# Altium schematic sheet airPi_Controller.schdoc
size 315 x 214 mm
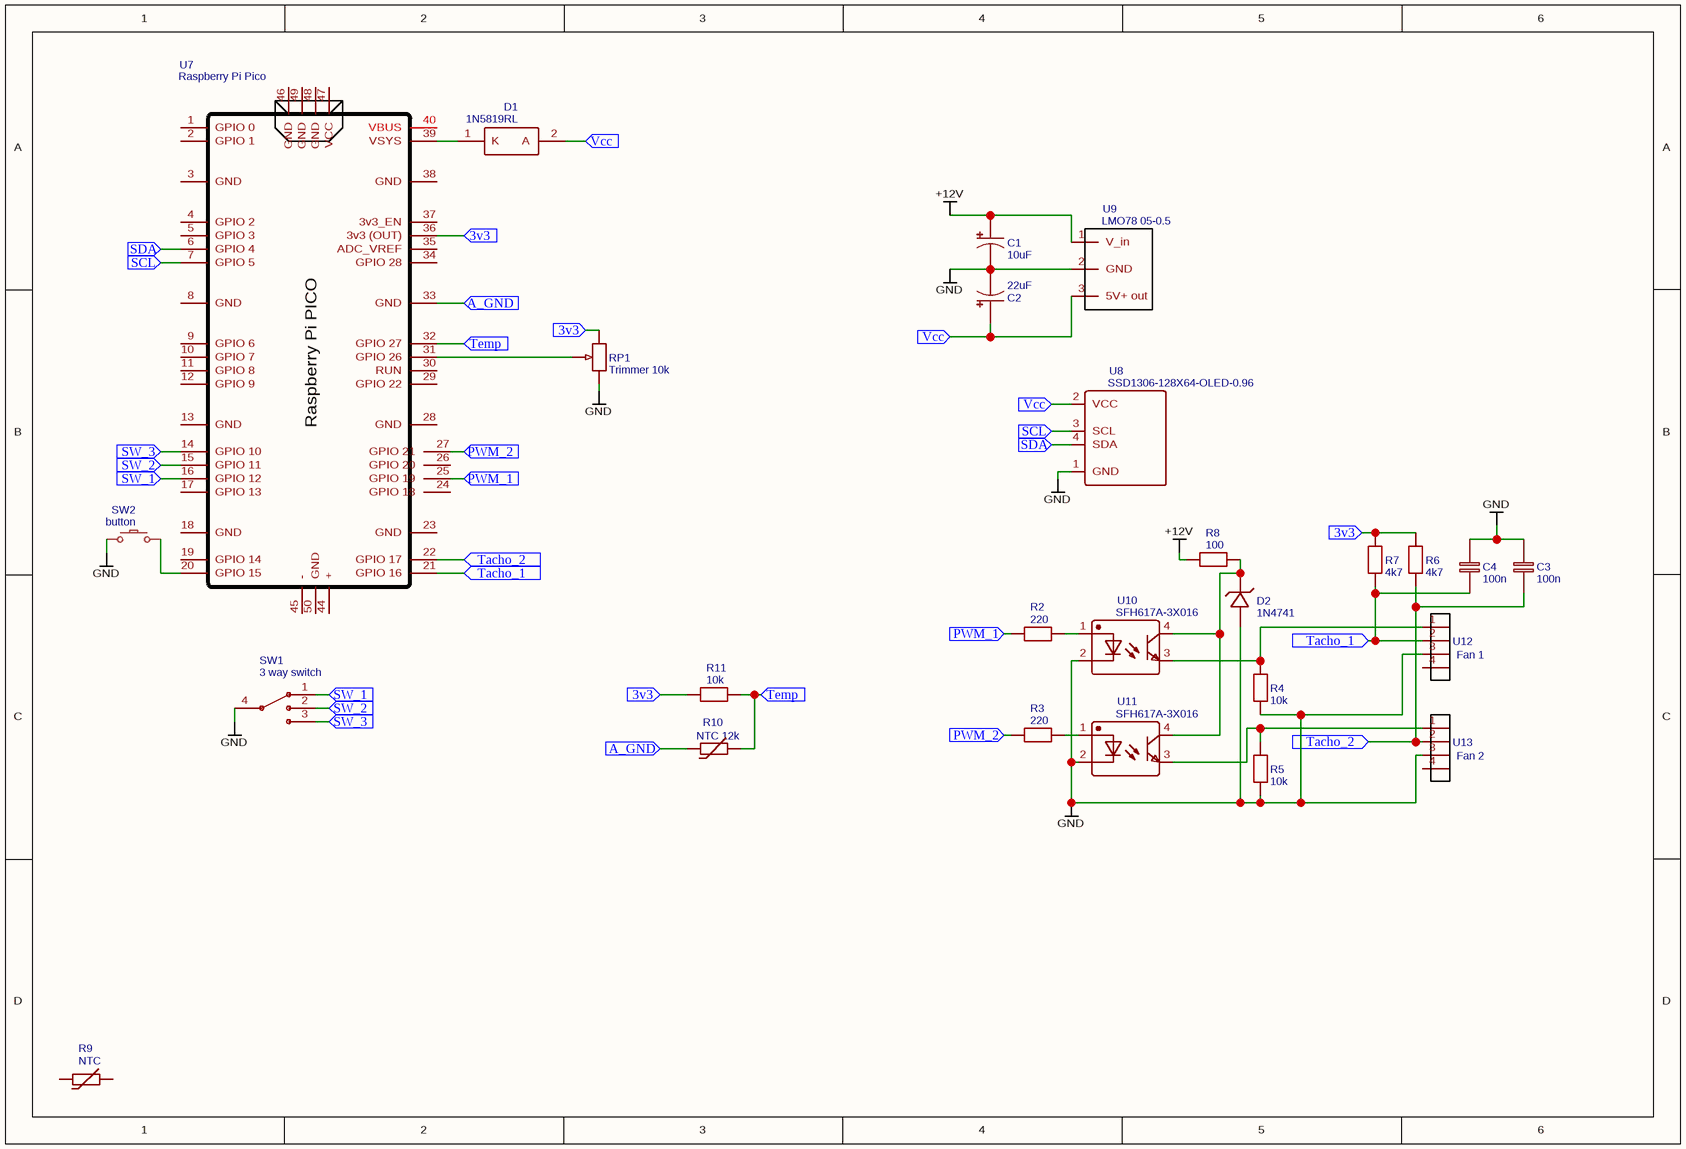
[diagram p0: airPi_Controller.schdoc]

## Parts
C1  10uF  [TANTALUM]
C2  22uF  [TANTALUM]
C3  100n  [C0603]
C4  100n  [C0603]
D1  1N5819RL  [ONSC-AXIAL_LEAD-2-59-10_P]
D2  1N4741  [DO-41_BD2.4-L4.7-P8.70-D0.9-RD]
R2  220  [R0603]
R3  220  [R0603]
R4  10k  [R0603]
R5  10k  [R0603]
R6  4k7  [R0603]
R7  4k7  [R0603]
R8  100  [R0603]
R9  NTC  [RES-TH_L10.5-W5.5-P7.50-D0.6-S5.50]
R10  NTC 12k  [RES-TH_L10.5-W5.5-P7.50-D0.6-S5.50]
R11  10k  [R0603]
RP1  Trimmer 10k  [RES-ADJ-TH_3386P]
SW1  3 way switch  [3 WAY SWITCH SMT]
SW2  button  [32TEETH---CONDUCTIVE-BUTTONS_CONDUCTIVE_BUTTON_DIRECTIONAL_THICK]
U7  Raspberry Pi Pico  [RASPBERRY PI PICO/ RASPBERRY PI PICO W]
U8  SSD1306-128X64-OLED-0.96  [SSD1306]
U9  LMO78 05-0.5  [5V DC/DC]
U10  SFH617A-3X016  [DIP-4_L6.5-W4.6-P2.54-LS10.2-BL]
U11  SFH617A-3X016  [DIP-4_L6.5-W4.6-P2.54-LS10.2-BL]
U12  Fan 1  [MOLEX_MINIFIT-JR-5569]
U13  Fan 2  [MOLEX_MINIFIT-JR-5569]

## Ports
3v3 (in), A_GND (in), PWM_1 (in), PWM_2 (in), SCL (in), SDA (in), SW_1 (in), SW_2 (in), SW_3 (in), Tacho_1 (in), Tacho_2 (in), Temp (in), Vcc (in)

## Nets
+12V: C1.1 R8.2 U9.1(V_in)
GND: C1.2 C2.2 C3.2 C4.2 D2.2(A) R4.1 R5.1 RP1.1 SW1.4 SW2.P$ACTIVE U8.1(GND) U9.2(GND) U10.2(C) U11.2(C) U12.3 U13.3
3v3: R6.2 R7.2 R11.1 RP1.3 U7.36(3v3_(OUT)) ; port 3v3
A_GND: R10.1 U7.33(GND) ; port A_GND
PWM_1: R2.1 U7.25(GPIO_19) ; port PWM_1
PWM_2: R3.1 U7.27(GPIO_21) ; port PWM_2
SCL: U7.7(GPIO_5) U8.3(SCL) ; port SCL
SDA: U7.6(GPIO_4) U8.4(SDA) ; port SDA
SW_1: SW1.1 U7.16(GPIO_12) ; port SW_1
SW_2: SW1.2 U7.15(GPIO_11) ; port SW_2
SW_3: SW1.3 U7.14(GPIO_10) ; port SW_3
Tacho_1: C4.1 R7.1 U7.21(GPIO_16) U12.2 ; port Tacho_1
Tacho_2: C3.1 R6.1 U7.22(GPIO_17) U13.2 ; port Tacho_2
Temp: R10.2 R11.2 U7.32(GPIO_27) ; port Temp
Vcc: C2.1 D1.2(A) U8.2(VCC) U9.3(5V+_out) ; port Vcc
NetD1_1: D1.1(K) U7.39(VSYS)
NetD2_1: D2.1(K) R8.1 U10.4(C) U11.4(C)
NetR2_2: R2.2 U10.1(A)
NetR3_2: R3.2 U11.1(A)
NetR4_2: R4.2 U10.3(E) U12.1
NetR5_2: R5.2 U11.3(E) U13.1
NetRP1_2: RP1.2 U7.31(GPIO_26)
NetSW2_P$GND: SW2.P$GND U7.20(GPIO_15)

Not connected (* = marked no-connect by the designer): R9 1 2; U7 1(GPIO_0) 2(GPIO_1) 3(GND) 4(GPIO_2) 5(GPIO_3) 8(GND) 9(GPIO_6) 10(GPIO_7) 11(GPIO_8) 12(GPIO_9) 13(GND) 17(GPIO_13) 18(GND) 19(GPIO_14) 23(GND) 24(GPIO_18) 26(GPIO_20) 28(GND) 29(GPIO_22) 30(RUN) 34(GPIO_28) 35(ADC_VREF) 37(3v3_EN) 38(GND) 40(VBUS) 44(+) 45(-) 46(GND) 47(VCC) 48(GND) 49(GND) 50(GND); U12 4; U13 4

## Notes on the sheet
- (in symbol Raspberry Pi Pico) Raspberry Pi PICO

## Library data of the parts
C1 = 10uF: nameAlias: Value(F); Contributor: hafiz_8030; spicePre: C; spiceSymbolName: TANTALE-10µF
C2 = 22uF: nameAlias: Value(F); Contributor: hafiz_8030; spicePre: C; spiceSymbolName: TANTALE-10µF
C3 C4 = 100n: nameAlias: Value(F); Contributor: LCEDA_Lib; spicePre: C; spiceSymbolName: C_0603_EU
D1 = 1N5819RL: description: Rectifier, 2-Pin Axial_Lead, Pb-Free, Tape and Reel; spicePre: D; spiceSymbolName: 1N5819RL
D2 = 1N4741: Manufacturer: onsemi(安森美); Manufacturer Part: 1N4741A; Contributor: LCSC; Supplier: LCSC; Supplier Part: C238927; JLCPCB Part Class: Extended Part; spicePre: D; spiceSymbolName: 1N4741A_C238927
R2 R3 = 220: nameAlias: Value(Ω); Contributor: LCEDA_Lib; spicePre: R; spiceSymbolName: R_0603_EU
R4 R5 R11 = 10k: nameAlias: Value(Ω); Contributor: LCEDA_Lib; spicePre: R; spiceSymbolName: R_0603_EU
R6 R7 = 4k7: nameAlias: Value(Ω); Contributor: LCEDA_Lib; spicePre: R; spiceSymbolName: R_0603_EU
R8 = 100: nameAlias: Value(Ω); Contributor: LCEDA_Lib; spicePre: R; spiceSymbolName: R_0603_EU
R9 = NTC: Manufacturer: RUILON(瑞隆源); Manufacturer Part: NTC 5D-9(弯脚); nameAlias: Value; Supplier: LCSC; Supplier Part: C3789; JLCPCB Part Class: Extended Part; spicePre: R; spiceSymbolName: NTC 5D-9
R10 = NTC 12k: Manufacturer: RUILON(瑞隆源); Manufacturer Part: NTC 5D-9(弯脚); nameAlias: Value; Supplier: LCSC; Supplier Part: C3789; JLCPCB Part Class: Extended Part; spicePre: R; spiceSymbolName: NTC 5D-9
RP1 = Trimmer 10k: nameAlias: Resistance (Ohms); Contributor: LCEDA_Lib; Supplier: LCSC; Value(Ω): 10K; spicePre: R; spiceSymbolName: R_3386P_EU
SW1 = 3 way switch: Manufacturer: ReliaPro; Manufacturer Part: MSK-11027 Toggle Switches; Contributor: ClivePCBDesign; Supplier Part: C21381; image: http://image.lceda.cn/szlcsc/C21381.jpg; spicePre: K; spiceSymbolName: 3 way switch
SW2 = button: Contributor: laura.puyet1; spicePre: ?; spiceSymbolName: button
U7 = Raspberry Pi Pico: Contributor: grawik; spicePre: U; spiceSymbolName: Raspberry Pi Pico
U8 = SSD1306-128X64-OLED-0.96: sourceId: wICUcuL3l; Contributor: Think Service; spicePre: X; timeStamp: 1456014235; spiceSymbolName: SSD1306-128X64-OLED-0.96
U9 = LMO78 05-0.5: Contributor: Martin Heiter; spicePre: U; spiceSymbolName: 5V DC/DC Converter Gaptec LMO78 05-0.5 2,5W
U10 U11 = SFH617A-3X016: Manufacturer: VISHAY(威世); Contributor: lcsc; Supplier: LCSC; Supplier Part: C5273047; Manufacturer Part: SFH617A-3X016; spicePre: U; spiceSymbolName: SFH617A-3X016
U12 = Fan 1: Contributor: s1atbewie.de; spicePre: U; spiceSymbolName: MolexMiniFit Jr 02*02
U13 = Fan 2: Contributor: s1atbewie.de; spicePre: U; spiceSymbolName: MolexMiniFit Jr 02*02